# EAGLE design mainboard (EAGLE 6.5.0)
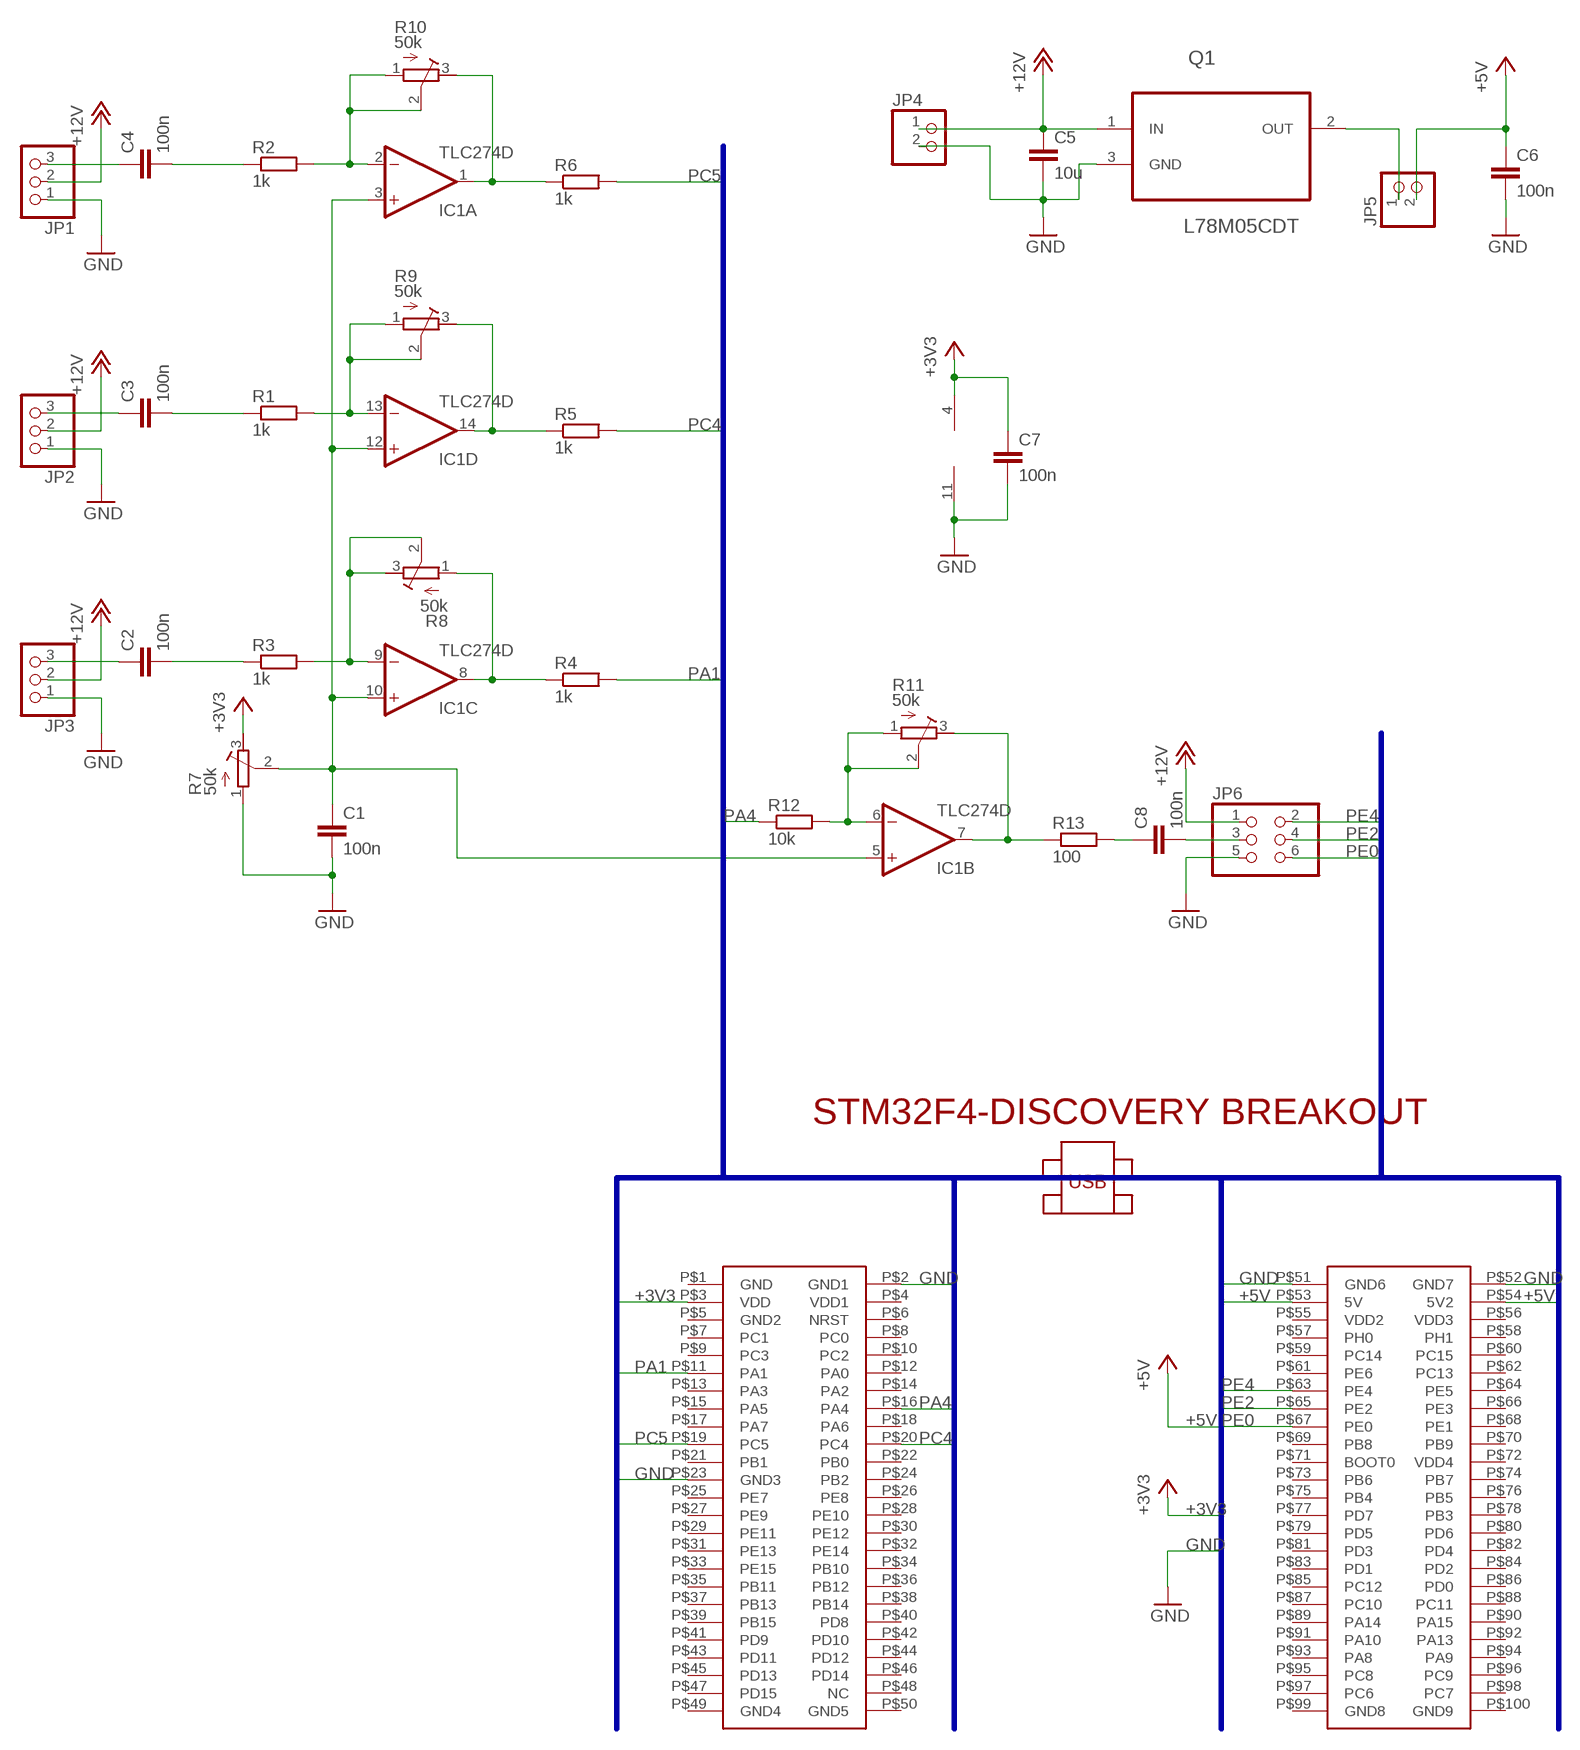
[diagram p0: schematic, sheet 1]

## Parts
C1  100n  C-EUC1206K  [C1206K]
C2  100n  C-EUC1206K  [C1206K]
C3  100n  C-EUC1206K  [C1206K]
C4  100n  C-EUC1206K  [C1206K]
C5  10u  C-EUC1206K  [C1206K]
C6  100n  C-EUC1206K  [C1206K]
C7  100n  C-EUC1206K  [C1206K]
C8  100n  C-EUC1206K  [C1206K]
IC1  TLC274D  [SO14]
JP1  PINHD-1X3  [1X03]
JP2  PINHD-1X3  [1X03]
JP3  PINHD-1X3  [1X03]
JP4  PINHD-1X2  [1X02]
JP5  PINHD-1X2  [1X02]
JP6  PINHD-2X3  [2X03]
Q1  L78M05CDT  [TO225P972X240-3N]
R1  1k  R-EU_M0805  [M0805]
R2  1k  R-EU_M0805  [M0805]
R3  1k  R-EU_M0805  [M0805]
R4  1k  R-EU_M0805  [M0805]
R5  1k  R-EU_R1206  [R1206]
R6  1k  R-EU_M0805  [M0805]
R7  50k  R-TRIMM3314J  [RTRIM3314J]
R8  50k  R-TRIMM3314J  [RTRIM3314J]
R9  50k  R-TRIMM3314J  [RTRIM3314J]
R10  50k  R-TRIMM3314J  [RTRIM3314J]
R11  50k  R-TRIMM3314J  [RTRIM3314J]
R12  10k  R-EU_M1206  [M1206]
R13  100  R-EU_M0805  [M0805]
U$1  STM32F4-DISCOVERY  [STM32F4-DISCOVERY]

## Nets
+3V3: C7.1 IC1.4(P:V+) R7.3(A) U$1.P$3(VDD)
+5V: C6.1 JP5.2 U$1.P$53(5V) U$1.P$54(5V2)
+12V: C5.1 JP1.2 JP2.2 JP3.2 JP4.1 JP6.1 Q1.1(IN)
GND: C1.2 C5.2 C6.2 C7.2 IC1.11(P:V-) JP1.1 JP2.1 JP3.1 JP4.2 JP6.5 Q1.3(GND) R7.1(E) U$1.P$2(GND1) U$1.P$23(GND3) U$1.P$51(GND6) U$1.P$52(GND7)
N$1: JP5.1 Q1.2(OUT)
N$2: IC1.6(B:-IN) R11.1(E) R11.2(S) R12.2
N$4: IC1.13(D:-IN) R1.2 R9.1(E) R9.2(S)
N$5: IC1.1(A:OUT) R6.1 R10.3(A)
N$6: IC1.8(C:OUT) R4.1 R8.1(E)
N$8: C2.2 R3.1
N$9: C2.1 JP3.3
N$10: C3.1 JP2.3
N$11: C4.1 JP1.3
N$12: C4.2 R2.1
N$13: IC1.7(B:OUT) R11.3(A) R13.1
N$14: IC1.14(D:OUT) R5.1 R9.3(A)
N$15: C3.2 R1.1
N$16: C1.1 IC1.3(A:+IN) IC1.5(B:+IN) IC1.10(C:+IN) IC1.12(D:+IN) R7.2(S)
N$17: C8.2 JP6.3
N$18: C8.1 R13.2
N$19: IC1.2(A:-IN) R2.2 R10.1(E) R10.2(S)
N$20: IC1.9(C:-IN) R3.2 R8.2(S) R8.3(A)
PA1: R4.2 U$1.P$11(PA1)
PA4: R12.1 U$1.P$16(PA4)
PC4: R5.2 U$1.P$20(PC4)
PC5: R6.2 U$1.P$19(PC5)
PE0: JP6.6 U$1.P$67(PE0)
PE2: JP6.4 U$1.P$65(PE2)
PE4: JP6.2 U$1.P$63(PE4)
Unconnected: U$1.P$1(GND) U$1.P$4(VDD1) U$1.P$5(GND2) U$1.P$6(NRST) U$1.P$7(PC1) U$1.P$8(PC0) U$1.P$9(PC3) U$1.P$10(PC2) U$1.P$12(PA0) U$1.P$13(PA3) U$1.P$14(PA2) U$1.P$15(PA5) U$1.P$17(PA7) U$1.P$18(PA6) U$1.P$21(PB1) U$1.P$22(PB0) U$1.P$24(PB2) U$1.P$25(PE7) U$1.P$26(PE8) U$1.P$27(PE9) U$1.P$28(PE10) U$1.P$29(PE11) U$1.P$30(PE12) U$1.P$31(PE13) U$1.P$32(PE14) U$1.P$33(PE15) U$1.P$34(PB10) U$1.P$35(PB11) U$1.P$36(PB12) U$1.P$37(PB13) U$1.P$38(PB14) U$1.P$39(PB15) U$1.P$40(PD8) U$1.P$41(PD9) U$1.P$42(PD10) U$1.P$43(PD11) U$1.P$44(PD12) U$1.P$45(PD13) U$1.P$46(PD14) U$1.P$47(PD15) U$1.P$48(NC) U$1.P$49(GND4) U$1.P$50(GND5) U$1.P$55(VDD2) U$1.P$56(VDD3) U$1.P$57(PH0) U$1.P$58(PH1) U$1.P$59(PC14) U$1.P$60(PC15) U$1.P$61(PE6) U$1.P$62(PC13) U$1.P$64(PE5) U$1.P$66(PE3) U$1.P$68(PE1) U$1.P$69(PB8) U$1.P$70(PB9) U$1.P$71(BOOT0) U$1.P$72(VDD4) U$1.P$73(PB6) U$1.P$74(PB7) U$1.P$75(PB4) U$1.P$76(PB5) U$1.P$77(PD7) U$1.P$78(PB3) U$1.P$79(PD5) U$1.P$80(PD6) U$1.P$81(PD3) U$1.P$82(PD4) U$1.P$83(PD1) U$1.P$84(PD2) U$1.P$85(PC12) U$1.P$86(PD0) U$1.P$87(PC10) U$1.P$88(PC11) U$1.P$89(PA14) U$1.P$90(PA15) U$1.P$91(PA10) U$1.P$92(PA13) U$1.P$93(PA8) U$1.P$94(PA9) U$1.P$95(PC8) U$1.P$96(PC9) U$1.P$97(PC6) U$1.P$98(PC7) U$1.P$99(GND8) U$1.P$100(GND9)

## Buses
PA[0..16],PC[0..16],PE[0..16],+5V,+3V3,GND

## Library data of the parts
C1-C8 = resistor:C-EU: CAPACITOR, European symbol
IC1 = linear:TLC274: OP AMP
JP1-JP3 = pinhead:PINHD-1X3: PIN HEADER
JP4 JP5 = pinhead:PINHD-1X2: PIN HEADER
JP6 = pinhead:PINHD-2X3: PIN HEADER
Q1 = ST Microelctronics_By_element14_Batch_1:L78M05CDT: Positive voltage regulators; MPN: L78M05CDT; OC_FARNELL: 1087116; OC_NEWARK: 78K5325; PACKAGE: DPAK; SUPPLIER: STMICROELECTRONICS
R1-R6 R12 R13 = resistor:R-EU_: RESISTOR, European symbol
R7-R11 = resistor:R-TRIMM: Trimm resistor
U$1 = STM32F4-DISCOVERY:STM32F4-DISCOVERY

## Board
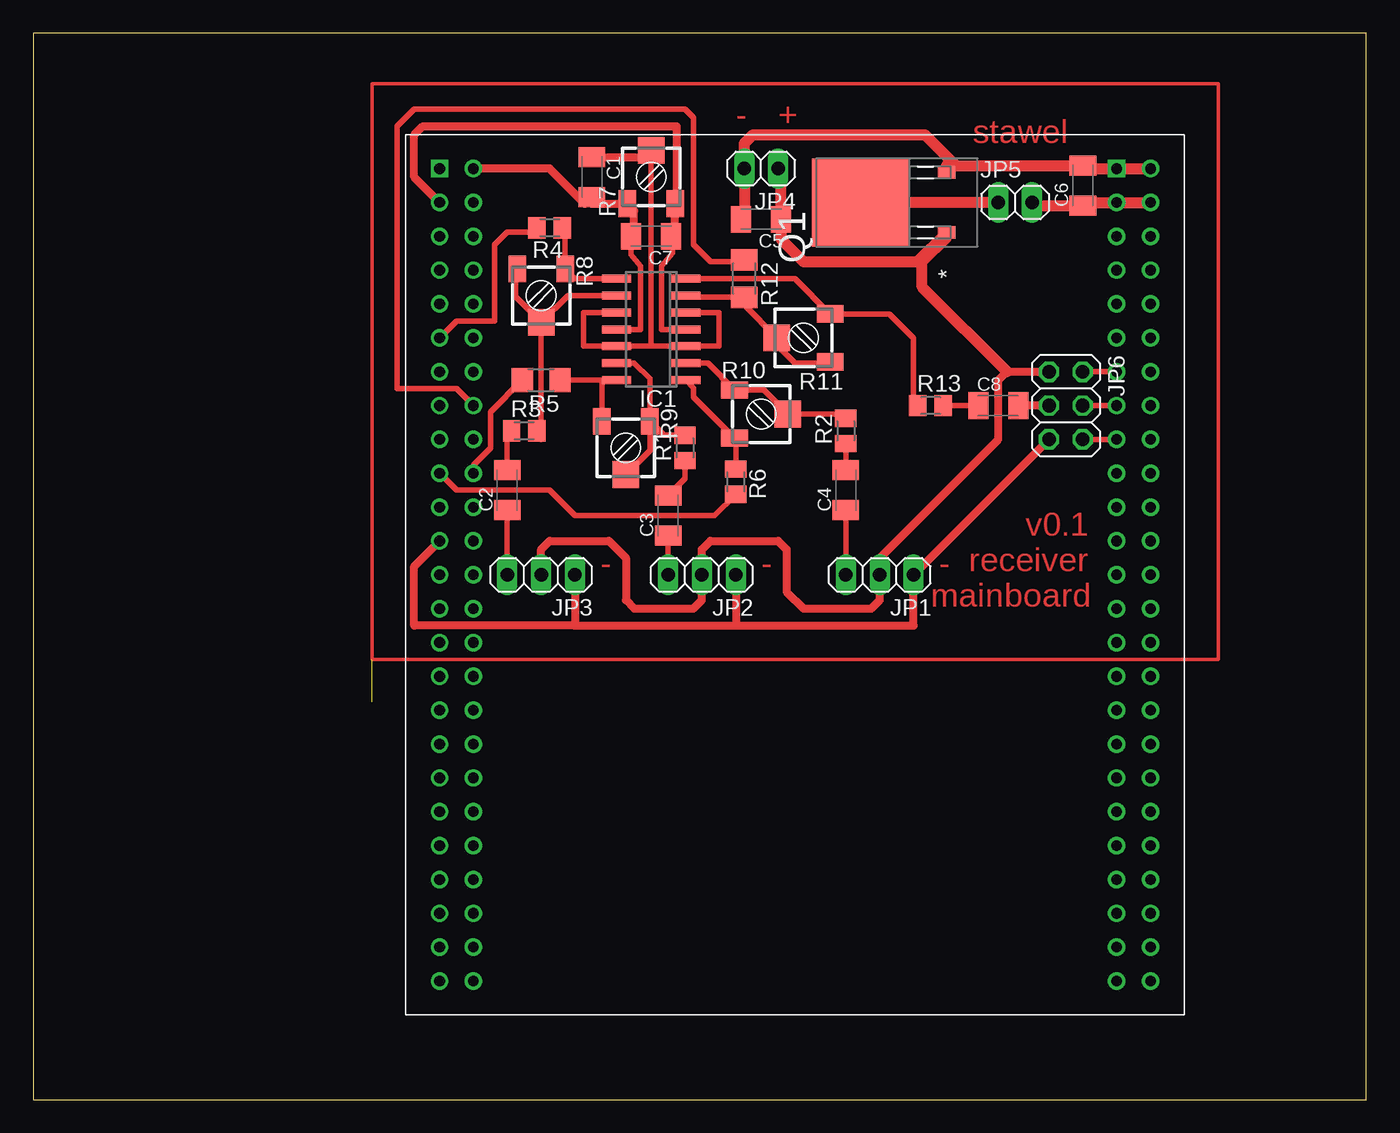
[diagram p1: board, top side]
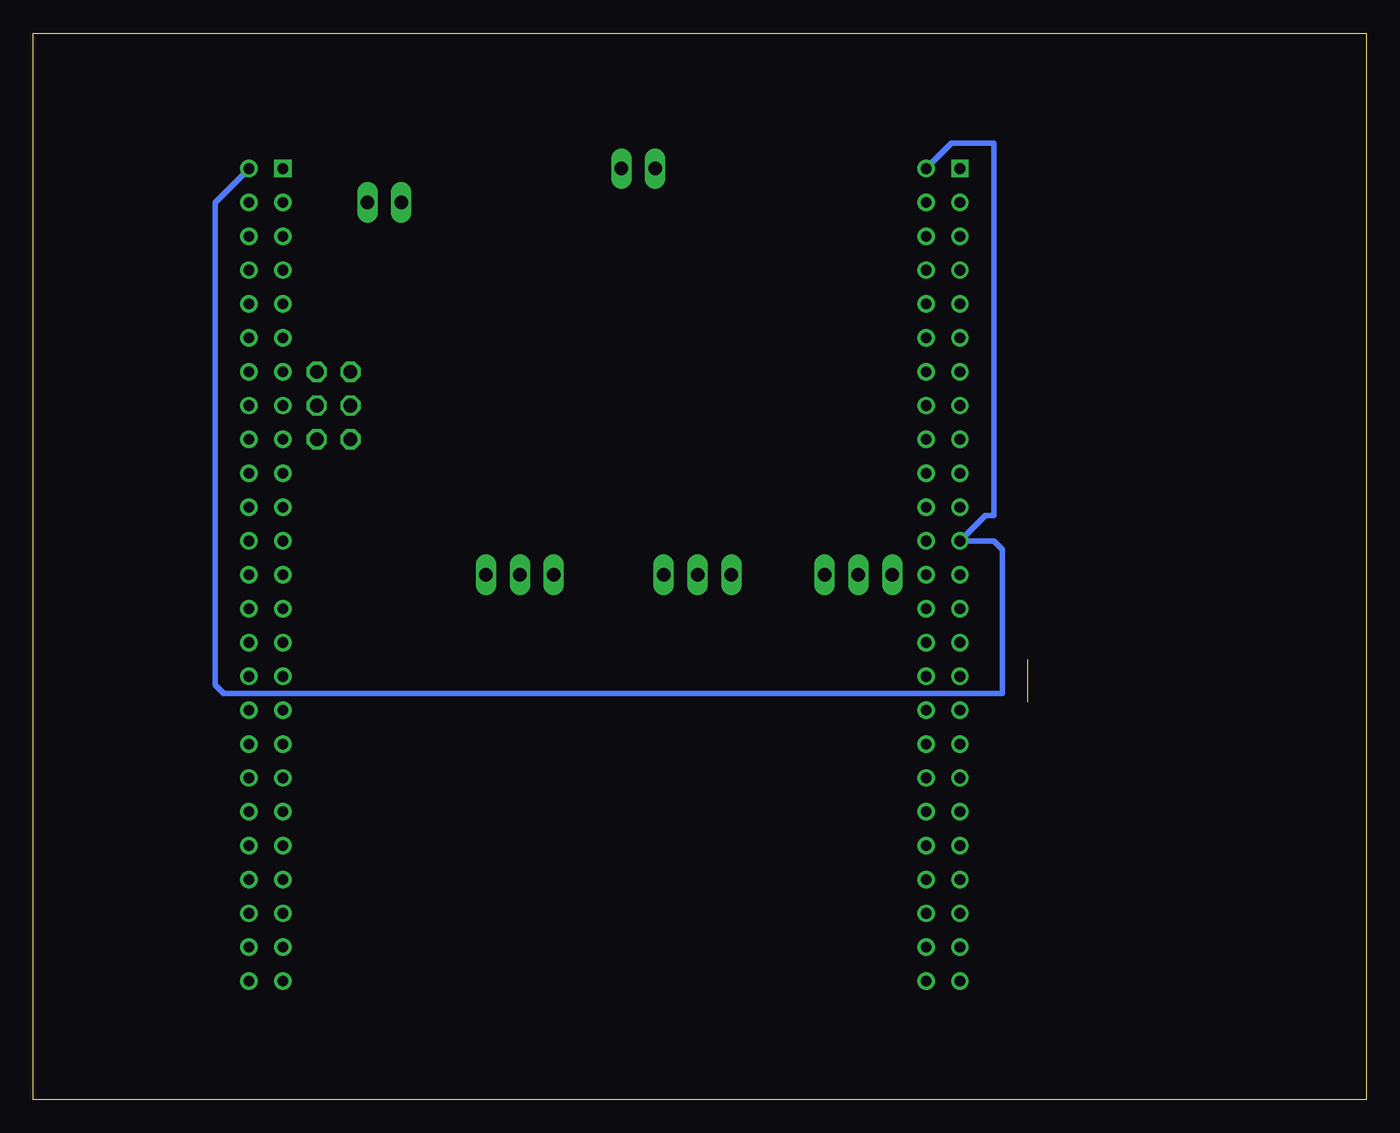
[diagram p2: board, bottom side, seen from below]

Size 100 x 80 mm. Coordinates in mm from the lower left corner, seen from the top.
Outline: 0,0 100,0 100,80 0,80 0,0
Copper layers (1*16): Top 0.035mm / dielectric 1.5mm / Bottom 0.035mm
Design rules "default": minimum track width 10mil, minimum drill 24mil, track to track 8mil, track to pad 8mil, pad to pad 8mil, via to via 8mil, smd to smd 8mil, copper to edge 40mil, drill to drill 8mil, minimum pad ring 10mil, minimum via ring 8mil, stop-mask expansion 4mil, vias tented up to drill 0mil, thermal gap 10mil

### Footprints (pad centres in the part's own frame; a part is rotated, then mirrored left to right if it is on the bottom)
C1206K = smd 1.5 x 2: 1 -1.5,0; 2 1.5,0
SO14 = smd 0.6 x 2.2: 1 -3.81,-2.6; 2 -2.54,-2.6; 3 -1.27,-2.6; 4 0,-2.6; 5 1.27,-2.6; 6 2.54,-2.6; 7 3.81,-2.6; 8 3.81,2.6; 9 2.54,2.6; 10 1.27,2.6; 11 0,2.6; 12 -1.27,2.6; 13 -2.54,2.6; 14 -3.81,2.6
1X03 = drill 1.016 long: 1 -2.54,0; 2 0,0; 3 2.54,0
1X02 = drill 1.016 long: 1 -1.27,0; 2 1.27,0
2X03 = drill 1.016 octagon: 1 -2.54,-1.27; 2 -2.54,1.27; 3 0,-1.27; 4 0,1.27; 5 2.54,-1.27; 6 2.54,1.27
TO225P972X240-3N = smd 0.94 x 1.321: 1 -2.261,-6.299; 3 2.261,-6.299 | smd 6.604 x 7.315: 2 0,0.152
M0805 = smd 1.3 x 1.6: 1 -0.95,0; 2 0.95,0
R1206 = smd 1.6 x 1.803: 1 -1.422,0; 2 1.422,0
RTRIM3314J = smd 1.3 x 2: 1 -1.8,-2; 3 1.8,-2 | smd 2 x 2: 2 0,2
M1206 = smd 1.6 x 2: 1 -1.4,0; 2 1.4,0
STM32F4-DISCOVERY = drill 0.8 square: P$1 -27.94,30.48; P$51 22.86,30.48 | drill 0.8: P$2 -25.4,30.48; P$3 -27.94,27.94; P$4 -25.4,27.94; P$5 -27.94,25.4; P$6 -25.4,25.4; P$7 -27.94,22.86; P$8 -25.4,22.86; P$9 -27.94,20.32; P$10 -25.4,20.32; P$11 -27.94,17.78; P$12 -25.4,17.78; P$13 -27.94,15.24; P$14 -25.4,15.24; P$15 -27.94,12.7; P$16 -25.4,12.7; P$17 -27.94,10.16; P$18 -25.4,10.16; P$19 -27.94,7.62; P$20 -25.4,7.62; P$21 -27.94,5.08; P$22 -25.4,5.08; P$23 -27.94,2.54; P$24 -25.4,2.54; P$25 -27.94,0; P$26 -25.4,0; P$27 -27.94,-2.54; P$28 -25.4,-2.54; P$29 -27.94,-5.08; P$30 -25.4,-5.08; P$31 -27.94,-7.62; P$32 -25.4,-7.62; P$33 -27.94,-10.16; P$34 -25.4,-10.16; P$35 -27.94,-12.7; P$36 -25.4,-12.7; P$37 -27.94,-15.24; P$38 -25.4,-15.24; P$39 -27.94,-17.78; P$40 -25.4,-17.78; P$41 -27.94,-20.32; P$42 -25.4,-20.32; P$43 -27.94,-22.86; P$44 -25.4,-22.86; P$45 -27.94,-25.4; P$46 -25.4,-25.4; P$47 -27.94,-27.94; P$48 -25.4,-27.94; P$49 -27.94,-30.48; P$50 -25.4,-30.48; P$52 25.4,30.48; P$53 22.86,27.94; P$54 25.4,27.94; P$55 22.86,25.4; P$56 25.4,25.4; P$57 22.86,22.86; P$58 25.4,22.86; P$59 22.86,20.32; P$60 25.4,20.32; P$61 22.86,17.78; P$62 25.4,17.78; P$63 22.86,15.24; P$64 25.4,15.24; P$65 22.86,12.7; P$66 25.4,12.7; P$67 22.86,10.16; P$68 25.4,10.16; P$69 22.86,7.62; P$70 25.4,7.62; P$71 22.86,5.08; P$72 25.4,5.08; P$73 22.86,2.54; P$74 25.4,2.54; P$75 22.86,0; P$76 25.4,0; P$77 22.86,-2.54; P$78 25.4,-2.54; P$79 22.86,-5.08; P$80 25.4,-5.08; P$81 22.86,-7.62; P$82 25.4,-7.62; P$83 22.86,-10.16; P$84 25.4,-10.16; P$85 22.86,-12.7; P$86 25.4,-12.7; P$87 22.86,-15.24; P$88 25.4,-15.24; P$89 22.86,-17.78; P$90 25.4,-17.78; P$91 22.86,-20.32; P$92 25.4,-20.32; P$93 22.86,-22.86; P$94 25.4,-22.86; P$95 22.86,-25.4; P$96 25.4,-25.4; P$97 22.86,-27.94; P$98 25.4,-27.94; P$99 22.86,-30.48; P$100 25.4,-30.48

### Placement (x,y rotation side)
C1  41.91,69.22 270 top
C2  35.56,45.72 90 top
C3  47.62,43.81 90 top
C4  60.96,45.72 90 top
C5  54.61,66.04 180 top
C6  78.74,68.58 90 top
C7  46.35,64.77 180 top
C8  72.39,52.07 0 top
IC1  46.35,57.78 90 top
JP1  63.5,39.37 180 top
JP2  50.16,39.37 180 top
JP3  38.1,39.37 180 top
JP4  54.61,69.85 180 top
JP5  73.66,67.31 0 top
JP6  77.47,52.07 270 top
Q1  62.23,67.31 90 top
R1  48.9,48.9 90 top
R2  60.96,50.16 90 top
R3  36.83,50.16 0 top
R4  38.73,65.41 180 top
R5  38.1,53.98 180 top
R6  52.7,46.35 270 top
R7  46.35,69.22 0 top
R8  38.1,60.33 180 top
R9  44.45,48.9 180 top
R10  54.61,51.44 270 top
R11  57.78,57.15 90 top
R12  53.34,61.59 270 top
R13  67.31,52.07 0 top
U$1  58.42,39.37 0 top

### Tracks (layer width: path | path; a pad name or v marks a point on that pad's centre or on a via)
+3V3
  Top 0.406: IC1.4 47.15,57.78 47.15,62.55 47.94,63.5 47.94,64.68 C7.1
  Top 0.61: C7.1 48.16,64.77 R7.3 48.26,67.32 48.26,73.03 29.21,73.03 28.57,72.39 28.57,69.22 U$1.P$3
+5V
  Top 0.813: JP5.2 74.93,67.08 C6.1 78.74,67.31 U$1.P$53 U$1.P$54
+12V
  Top 0.61: JP3.2 38.1,41.27 38.73,41.91 43.18,41.91 44.45,40.64 44.45,37.47 45.09,36.83 49.53,36.83 50.16,37.47 JP2.2 50.16,41.27 50.8,41.91 55.88,41.91 56.52,41.27 56.52,38.1 57.78,36.83 62.87,36.83 63.5,37.47 JP1.2 63.5,40.64 72.39,49.53 72.39,53.98 73.03,54.61 JP6.1
  Top 0.813: JP4.1 56.11,69.62 C5.1 56.11,64.54 57.78,62.87 66.34,62.87 Q1.1 68.53,64.72 66.67,62.87 66.67,60.96 73.03,54.61
GND
  Top 0.406: IC1.11 45.56,57.78 45.56,62.55 44.85,63.41 C7.2
  Top 0.61: 41.91,67.22 C1.2 | 40.64,35.56 28.57,35.56 28.57,40.01 U$1.P$23 | 40.64,35.56 52.7,35.56 | 52.7,35.56 66.04,35.56 JP1.1 JP6.5 | JP2.1 52.7,35.56 | JP3.1 40.64,35.56 | C7.2 45.09,64.77 45.09,66.69 R7.1 41.91,67.22 | 41.91,67.22 41.37,67.22 38.73,69.85 U$1.P$2
  Top 0.813: Q1.3 68.53,70.08 69.22,70.08 | 69.22,70.08 C6.2 78.74,69.85 U$1.P$51 U$1.P$52 | 69.22,70.08 66.91,72.39 53.98,72.39 53.34,71.75 JP4.2 53.34,66.27 C5.2
  Bottom 0.406: U$1.P$2 31.11,71.75 27.94,71.75 27.94,43.81 28.57,43.81 U$1.P$23 27.94,41.91 27.3,41.27 27.3,30.48 85.72,30.48 86.36,31.11 86.36,67.31 U$1.P$52
N$1
  Top 0.813: JP5.1 Q1.2
N$2
  Top 0.406: IC1.6 49.09,60.2 R12.2 53.34,59.59 R11.2 55.78,56.61 57.15,55.24 59.68,55.24 R11.1
N$3  (1 unrouted)
  Top 0.254: 25.4,33.02 25.4,76.2 88.9,76.2 88.9,33.02 25.4,33.02
N$4
  Top 0.406: R9.2 46.25,48.7 R9.1 | R9.1 46.25,54.08 45.09,55.24 IC1.13 | R1.2 47.3,49.84 R9.1
N$5
  Top 0.406: R6.1 52.7,49.54 R10.3 49.53,52.7 49.53,53.4 IC1.1
N$6
  Top 0.406: IC1.8 40.63,61.59 R8.1 39.9,65.19 R4.1
N$8
  Top 0.406: C2.2 35.56,49.84 R3.1
N$9
  Top 0.406: C2.1 JP3.3
N$10
  Top 0.406: C3.1 JP2.3
N$11
  Top 0.406: C4.1 JP1.3
N$12
  Top 0.406: R2.1 C4.2
N$13
  Top 0.406: IC1.7 57.15,61.59 R11.3 64.24,58.95 66.04,57.15 66.04,52.39 R13.1
N$14
  Top 0.406: R5.1 42.55,53.98 | 42.55,53.98 IC1.14 | R9.3 42.65,53.87 42.55,53.98
N$15
  Top 0.406: R1.1 48.9,46.59 C3.2
N$16
  Top 0.406: R7.2 46.35,56.52 | 46.35,56.52 IC1.12 41.27,56.52 41.27,59.05 IC1.10 | 46.35,56.52 IC1.3 51.44,56.52 51.44,59.05 IC1.5
  Top 0.61: C1.1 46.35,70.72 R7.2
N$17
  Top 0.61: JP6.3 C8.2
N$18
  Top 0.406: C8.1 R13.2
N$19
  Top 0.406: IC1.2 50.6,55.24 R10.1 54.81,53.23 R10.2 60.64,51.44 R2.2
N$20
  Top 0.406: IC1.9 40.1,60.33 R8.2 | 38.1,50.16 R3.2 37.78,49.85 38.1,49.53 R8.2 | R8.3 36.3,61.7 36.2,61.59 36.2,60.23 R8.2
PA1
  Top 0.406: U$1.P$11 31.75,58.42 34.61,58.42 34.61,64.14 35.56,65.09 37.47,65.09 R4.2
PA4
  Top 0.406: U$1.P$16 31.75,53.34 27.3,53.34 27.3,73.03 28.57,74.3 48.9,74.3 49.53,73.66 49.53,64.14 50.8,62.87 53.21,62.87 R12.1
PC4
  Top 0.406: U$1.P$20 33.02,47.62 34.29,48.9 34.29,51.59 R5.2
PC5
  Top 0.406: U$1.P$19 31.75,45.72 38.73,45.72 40.64,43.81 51.12,43.81 R6.2
PE0
  Top 0.406: JP6.6 U$1.P$67
PE2
  Top 0.406: JP6.4 U$1.P$65
PE4
  Top 0.406: JP6.2 U$1.P$63

### Text on the board
Top: - | + | stawel | - | - | - | v0.1 / receiver / mainboard